# Altium project MB1248.PrjPCB (part 3 of 3)

## Sheet LCD&Camera Connectors.SchDoc: LCD & Camera connectors
size A4; Project: STM32H7-DK; Date: Not used; ApprovedBy: Not used; CheckedBy: Not used; Author: Not used; CompanyName: STMicroelectronics; DrawnBy: Not used; Engineer: Not used; Organization: Not used; Address1: Not used; Address2: Not used; Address3: Not used; Address4: Not used; DocumentNumber: Not used; Revision: Not used; SheetNumber: 7; SheetTotal: 16; CurrentTime: Not used; CurrentDate: Not used; Time: Not used; DocumentFullPathAndName: Not used; DocumentName: Not used; ModifiedDate: Not used; ImagePath: Not used; ProjectName: Not used; Application_BuildNumber: Not used
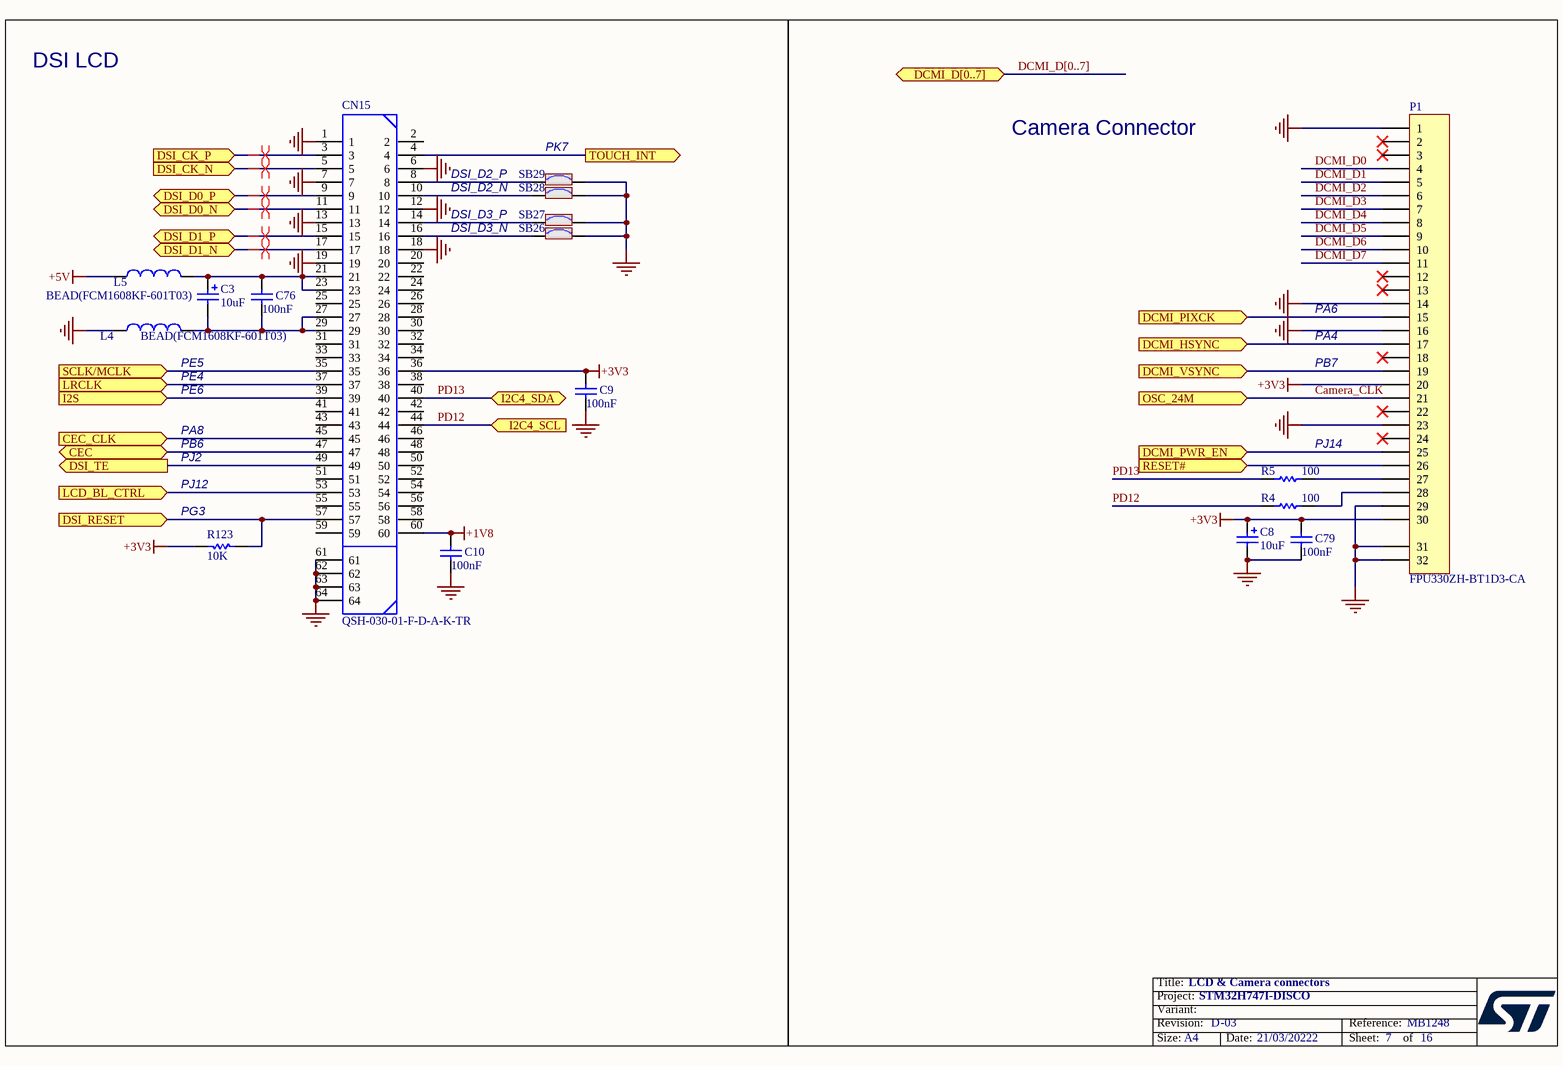
[diagram p11: LCD&Camera Connectors.SchDoc]

### Parts
C3  10uF  [TAN-A]
C8  10uF  [TAN-A]
C9  100nF  [0603C]
C10  100nF  [0603C]
C76  100nF  [0603C]
C79  100nF  [0603C]
CN15  QSH-030-01-F-D-A-K-TR  [QSH-030-01-F-D-A]
L4  BEAD(FCM1608KF-601T03)  [0603L]
L5  BEAD(FCM1608KF-601T03)  [0603L]
P1  FPU330ZH-BT1D3-CA  [FPU330ZH-BT1D3-CA]
R4  100  [0603R]
R5  100  [0603R]
R123  10K  [0603R]
SB26  Solder Bridge ON  [SB_0603]  (value not drawn)
SB27  Solder Bridge ON  [SB_0603]  (value not drawn)
SB28  Solder Bridge ON  [SB_0603]  (value not drawn)
SB29  Solder Bridge ON  [SB_0603]  (value not drawn)

### Ports
CEC (bidir), CEC_CLK (in), DCMI_D[0..7] (bidir), DCMI_HSYNC (in), DCMI_PIXCK (in), DCMI_PWR_EN (in), DCMI_VSYNC (in), DSI_CK_N (in), DSI_CK_P (in), DSI_D0_N (bidir), DSI_D0_P (bidir), DSI_D1_N (bidir), DSI_D1_P (bidir), DSI_RESET (in), DSI_TE (out), I2C4_SCL (in), I2C4_SDA (bidir), I2S (in), LCD_BL_CTRL (in), LRCLK (in), OSC_24M (in), RESET# (in), SCLK/MCLK (in), TOUCH_INT (out)

### Nets
+1V8: C10.1 CN15.60
+3V3: C8.1 C9.1 C79.2 CN15.36 P1.20 P1.30 R123.2
+5V: L5.1
GND: C8.2 C9.2 C10.2 C79.1 CN15.1 CN15.6 CN15.7 CN15.12 CN15.13 CN15.18 CN15.19 CN15.61 CN15.62 CN15.63 CN15.64 L4.1 P1.1 P1.14 P1.16 P1.23 P1.29 P1.31 P1.32 SB26.2 SB27.2 SB28.2 SB29.2
Camera_CLK: P1.21 ; port OSC_24M
DCMI_D0: P1.4
DCMI_D1: P1.5
DCMI_D2: P1.6
DCMI_D3: P1.7
DCMI_D4: P1.8
DCMI_D5: P1.9
DCMI_D6: P1.10
DCMI_D7: P1.11
PA4: P1.17 ; port DCMI_HSYNC
PA6: P1.15 ; port DCMI_PIXCK
PA8: CN15.45 ; port CEC_CLK
PB6: CN15.47 ; port CEC
PB7: P1.19 ; port DCMI_VSYNC
PD12: CN15.44 R4.1 ; port I2C4_SCL
PD13: CN15.40 R5.1 ; port I2C4_SDA
PG3: CN15.57 R123.1 ; port DSI_RESET
PJ2: CN15.49 ; port DSI_TE
PJ12: CN15.53 ; port LCD_BL_CTRL
PJ14: P1.25 ; port DCMI_PWR_EN
PK7: CN15.4 ; port TOUCH_INT
NetB1_2: P1.26 ; port RESET#
NetC3_1: C3.1 C76.1 CN15.21 CN15.23 L5.2
NetC3_2: C3.2 C76.2 CN15.27 CN15.29 L4.2
NetCN15_3: CN15.3 ; port DSI_CK_P
NetCN15_5: CN15.5 ; port DSI_CK_N
NetCN15_8: CN15.8 SB29.1
NetCN15_9: CN15.9 ; port DSI_D0_P
NetCN15_10: CN15.10 SB28.1
NetCN15_11: CN15.11 ; port DSI_D0_N
NetCN15_14: CN15.14 SB27.1
NetCN15_15: CN15.15 ; port DSI_D1_P
NetCN15_16: CN15.16 SB26.1
NetCN15_17: CN15.17 ; port DSI_D1_N
NetCN15_35: CN15.35 ; port SCLK/MCLK
NetCN15_37: CN15.37 ; port LRCLK
NetCN15_39: CN15.39 ; port I2S
NetP1_27: P1.27 R5.2
NetP1_28: P1.28 R4.2

Not connected (* = marked no-connect by the designer): CN15 2 20 22 24 25 26 28 30 31 32 33 34 38 41 42 43 46 48 50 51 52 54 55 56 58 59; P1 2* 3* 12* 13* 18* 22* 24*

### Buses and harness runs
bus DCMI_D[0..7] = port DCMI_D[0..7]

### Layout directives
differential pair: NetCN15_3, NetCN15_5, NetCN15_9, NetCN15_11, NetCN15_15, NetCN15_17

### Notes on the sheet
- DSI LCD
- DSI_D2_P
- DSI_D2_N
- PK7
- Camera Connector
- DSI_D3_P
- DSI_D3_N
- PA6
- PE6
- (near L4) PE5
- (near L4) PE4
- PA4
- PB7
- PJ2
- PB6
- PA8
- (near R5) PJ14
- PJ12
- (near R123) PG3
- Title:
- Project:
- Size:
- Revision:
- Variant:
- A4
- -
- Date:
- Reference:
- Sheet:
- of

### Library data of the parts
C3 C8 = Cap_10uF_POL_10%_TANA: Polarized Capacitor,10uF,10V,10%,typeA,VISHAY; Manuf_Part_1: 293D106X9010A2TE3; Revision: July-2002: Re-released for DXP Platform.; Value: 10uF; Manuf_1: VISHAY; Order: *; ECCN_US/EU: n/a
C9 C10 C76 = Cap: Capacitor; Value: 10nF; Published: 8-Jun-2000; Revision: July-2002: Re-released for DXP Platform.; Publisher: Altium Limited
C79 = Cap_100nF_X7R_10%_0402: Capacitor,100nF,16V,X7R,10%,0402,YAGEO; Revision: July-2002: Re-released for DXP Platform.; Value: 100nF; Manuf_1: YAGEO
CN15 = QSH-030-01-F-D-A: HIGH SPEED SOCKET STRIP, .5mm PITCH, 60 PINS; MANUFACTURER: SAMTEC; PCB DECAL: QSH-030-01-X-D-A; CREATED: 28 JAN 2014 - WENDY XIN
L4 L5 = Inductor: Value: 100uH; Published: 8-Jun-2000; Revision: July-2002: Re-released for DXP Platform.; Publisher: Altium Limited
P1 = FPU330ZH-BT1D3-CA: TOWNES -  Connector FFC/FPC ZIF 0.5mm 30 pins, Lower Contacts; Manuf_Part_2: TFP-A330ZH-BT1-ECX; Manuf_Part_1: FPU330ZH-BT1D3-CA; Order: *; Manuf_1: TOWNES; Distrib: Sub Co; ECCN_US/EU: n/a; Manuf_2: TOWNES
R4 R5 = Res_100_1%_0402: Resistor,100,0402,1%,YAGEO; Order: 9239111; Value: 100; Manuf_1: YAGEO; ECCN_US/EU: n/a; Distrib: FARNELL
R123 = Res1: Resistor; Value: 1K; Published: 8-Jun-2000; Revision: July-2002: Re-released for DXP Platform.; Publisher: Altium Limited
SB26-SB29 = SB_ON: Fitted: YES; Ordered by: Subcon; Revision: July-2002: Re-released for DXP Platform.; ECCN_US/EU: n/a

## Sheet DEBUG.SchDoc: TAG Connector
size A4; Project: STM32H7-DK; Date: Not used; ApprovedBy: Not used; CheckedBy: Not used; Author: Not used; CompanyName: STMicroelectronics; DrawnBy: Not used; Engineer: Not used; Organization: Not used; Address1: Not used; Address2: Not used; Address3: Not used; Address4: Not used; DocumentNumber: Not used; Revision: Not used; SheetNumber: 13; SheetTotal: 16; CurrentTime: Not used; CurrentDate: Not used; Time: Not used; DocumentFullPathAndName: Not used; DocumentName: Not used; ModifiedDate: Not used; ImagePath: Not used; ProjectName: Not used; Application_BuildNumber: Not used
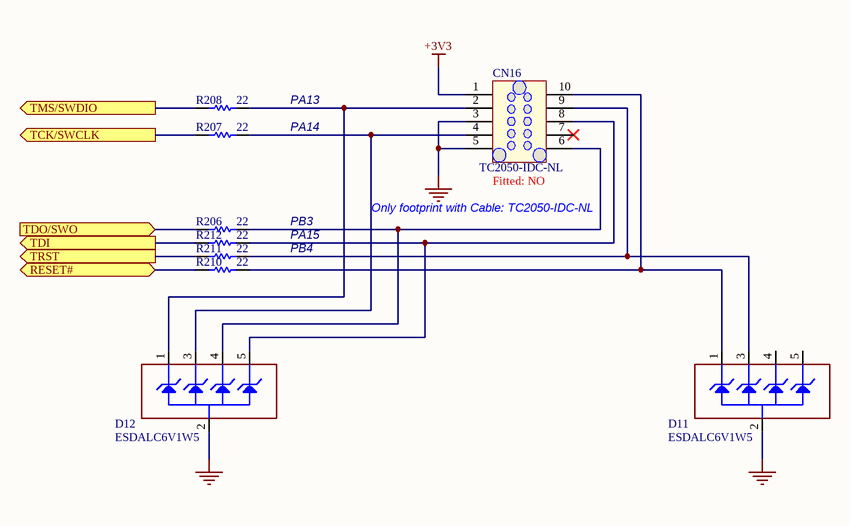
[diagram p12: DEBUG.SchDoc]

### Parts
CN16  TC2050-IDC-NL  Fitted: NO  [TC2050-IDC-NL]
D11  ESDALC6V1W5  [SC70-5]
D12  ESDALC6V1W5  [SC70-5]
R206  22  [0603R]
R207  22  [0603R]
R208  22  [0603R]
R210  22  [0603R]
R211  22  [0603R]
R212  22  [0603R]

### Ports
RESET# (bidir), TCK/SWCLK (out), TDI (out), TDO/SWO (in), TMS/SWDIO (out), TRST (out)

### Nets
+3V3: CN16.1
GND: CN16.3 CN16.5 D11.2(GND) D12.2(GND)
PA13: R208.2 ; port TMS/SWDIO
PA14: R207.2 ; port TCK/SWCLK
PA15: R212.2 ; port TDI
PB3: R206.2 ; port TDO/SWO
PB4: R211.2 ; port TRST
NetB1_2: R210.2 ; port RESET#
NetCN16_2: CN16.2 D12.1(IO1) R208.1
NetCN16_4: CN16.4 D12.3(IO2) R207.1
NetCN16_6: CN16.6 D12.4(IO3) R206.1
NetCN16_8: CN16.8 D12.5(IO4) R212.1
NetCN16_9: CN16.9 D11.3(IO2) R211.1
NetCN16_10: CN16.10 D11.1(IO1) R210.1

Not connected (* = marked no-connect by the designer): CN16 7*; D11 4(IO3) 5(IO4)

### Notes on the sheet
- PA13
- PA14
- PB3
- Only footprint with Cable: TC2050-IDC-NL
- PA15
- PB4
- Title:
- Project:
- Size:
- Revision:
- Variant:
- A4
- -
- Date:
- Reference:
- Sheet:
- of

### Library data of the parts
CN16 = Tag-10-C: Tag_Connector Header, 10-Pin, Dual row No legs; Manuf_Part_1: TC2050-IDC-NL-FP; Ordered_By: Subcon; Distrib: *; ECCN_US/EU: n/a; Manuf_1: Tag_connect; Order_code: *; Value: TC2050-IDC-NL; Ordered by: Subcon
D11 D12 = ESDALC6V1W5: Dual Transil array for ESD protection; Manuf_1: STM; Ref St: 9179034; Fitted: YES; ECCN_US/EU: EAR99/NEC; Manuf_Part_1: ESDALC6V1W5; Distrib: ST; Order: ESDALC6V1W5; Ordered by: STM
R206-R208 R210-R212 = Res1: Resistor; Value: 1K; Published: 8-Jun-2000; Revision: July-2002: Re-released for DXP Platform.; Publisher: Altium Limited

## Sheet STLink_V3E_Module.SchDoc: STLINK V3E Module
size A4; Project: STM32H7-DK; Date: Not used; ApprovedBy: Not used; CheckedBy: Not used; Author: Not used; CompanyName: STMicroelectronics; DrawnBy: Not used; Engineer: Not used; Organization: Not used; Address1: Not used; Address2: Not used; Address3: Not used; Address4: Not used; DocumentNumber: Not used; Revision: Not used; SheetNumber: 12; SheetTotal: 16; CurrentTime: Not used; CurrentDate: Not used; Time: Not used; DocumentFullPathAndName: Not used; DocumentName: Not used; ModifiedDate: Not used; ImagePath: Not used; ProjectName: Not used; Application_BuildNumber: Not used
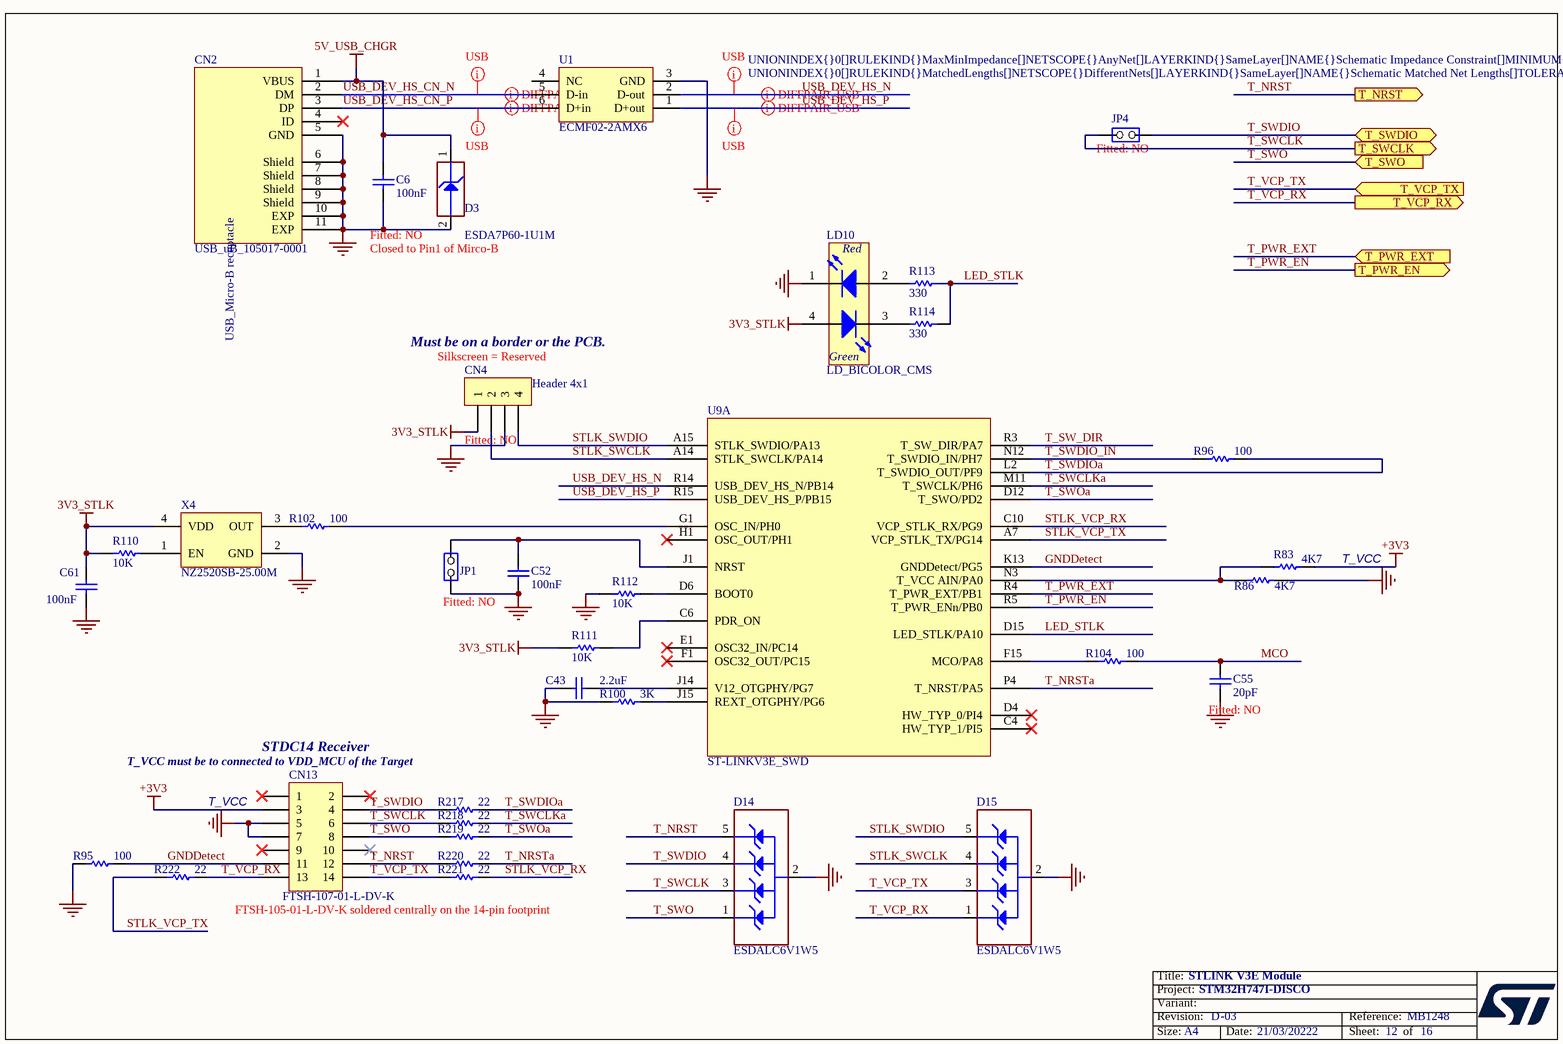
[diagram p13: STLink_V3E_Module.SchDoc]

### Parts
C6  value 100nF  Fitted: NO  [0402C]  (hidden comment: [N/A])
C43  2.2uF  [0603C]
C52  100nF  [0402C]
C55  value 20pF  Fitted: NO  [0402C]  (hidden comment: [N/A])
C61  100nF  [0402C]
CN2  value USB_uB_105017-0001  [MICRO_USB_B_105017]  (hidden comment: USB_uB_105017.0001)
CN4  Fitted: NO  [HDR_1X4_2R54]  (hidden comment: Header 4x1)
CN13  FTSH-107-01-L-DV-K  [FTSH-107-01-L-DV_B]
D3  ESDA7P60-1U1M  [DO_2SM_1R6X1_21]
D14  ESDALC6V1W5  [SC70-5]
D15  ESDALC6V1W5  [SC70-5]
JP1  Fitted: NO  [SIP2]  (hidden comment: Jumper Header 2x1)
JP4  Fitted: NO  [SIP2]  (hidden comment: Jumper Header 2x1)
LD10  LD_BICOLOR_CMS  [LED2_3528]
R83  4K7  [0402R]
R86  4K7  [0402R]
R95  100  [0402R]
R96  100  [0402R]
R100  3K  [0402R]
R102  100  [0402R]
R104  100  [0402R]
R110  10K  [0402R]
R111  10K  [0402R]
R112  10K  [0402R]
R113  330  [0603R]
R114  330  [0603R]
R217  22  [0603R]
R218  22  [0603R]
R219  22  [0603R]
R220  22  [0603R]
R221  22  [0603R]
R222  22  [0603R]
U1  ECMF02-2AMX6  [DFN6_0R5_1R7X1R5]
U9  ST-LINKV3E_SWD  [BGA176_0R65_10x10]  (part A of 2)
X4  NZ2520SB-25.00M  [OSC_4SM_2R5X2]

### Ports
T_NRST (out), T_PWR_EN (out), T_PWR_EXT (in), T_SWCLK (out), T_SWDIO (bidir), T_SWO (in), T_VCP_RX (out), T_VCP_TX (in)

### Nets
3V3_STLK: C61.2 CN4.1 LD10.4(YellowGreen_anode) R110.1 R111.1 X4.4(VDD)
5V_USB_CHGR: C6.2 CN2.1(VBUS) D3.1(IO1)
+3V3: CN13.3 R83.2
GND: C6.1 C43.1 C52.1 C55.1 C61.1 CN2.5(GND) CN2.6(Shield) CN2.7(Shield) CN2.8(Shield) CN2.9(Shield) CN2.10(EXP) CN2.11(EXP) CN4.3 CN13.5 CN13.7 D3.2(GND) D14.2(GND) D15.2(GND) JP1.1(COMMON) LD10.1(RED_cathode) R86.2 R95.1 R100.1 R112.1 U1.3(GND) X4.2(GND)
GNDDetect: CN13.11 R95.2 U9.K13(GNDDetect/PG5)
LED_STLK: R113.2 R114.2 U9.D15(LED_STLK/PA10)
MCO: C55.2 R104.2
STLK_SWCLK: CN4.2 D15.4(IO3) U9.A14(STLK_SWCLK/PA14)
STLK_SWDIO: CN4.4 D15.5(IO4) U9.A15(STLK_SWDIO/PA13)
STLK_VCP_RX: R221.1 U9.C10(VCP_STLK_RX/PG9)
STLK_VCP_TX: R222.2 U9.A7(VCP_STLK_TX/PG14)
T_NRST: CN13.12 D14.5(IO4) R220.2 ; port T_NRST
T_NRSTa: R220.1 U9.P4(T_NRST/PA5)
T_PWR_EN: U9.R5(T_PWR_ENn/PB0) ; port T_PWR_EN
T_PWR_EXT: U9.R4(T_PWR_EXT/PB1) ; port T_PWR_EXT
T_SW_DIR: U9.R3(T_SW_DIR/PA7)
T_SWCLK: CN13.6 D14.3(IO2) JP4.1(COMMON) R218.2 ; port T_SWCLK
T_SWCLKa: R218.1 U9.M11(T_SWCLK/PH6)
T_SWDIO: CN13.4 D14.4(IO3) JP4.2(NO) R217.2 ; port T_SWDIO
T_SWDIO_IN: R96.1 U9.N12(T_SWDIO_IN/PH7)
T_SWDIOa: R96.2 R217.1 U9.L2(T_SWDIO_OUT/PF9)
T_SWO: CN13.8 D14.1(IO1) R219.2 ; port T_SWO
T_SWOa: R219.1 U9.D12(T_SWO/PD2)
T_VCP_RX: CN13.13 D15.1(IO1) R222.1 ; port T_VCP_RX
T_VCP_TX: CN13.14 D15.3(IO2) R221.2 ; port T_VCP_TX
USB_DEV_HS_CN_N: CN2.2(DM) U1.5(D-in)
USB_DEV_HS_CN_P: CN2.3(DP) U1.6(D+in)
USB_DEV_HS_N: U1.2(D-out) U9.R14(USB_DEV_HS_N/PB14)
USB_DEV_HS_P: U1.1(D+out) U9.R15(USB_DEV_HS_P/PB15)
NetC43_2: C43.2 U9.J14(V12_OTGPHY/PG7)
NetC52_2: C52.2 JP1.2(NO) U9.J1(NRST)
NetLD10_2: LD10.2(Red_anode) R113.1
NetLD10_3: LD10.3(YellowGreen_cathode) R114.1
NetR83_1: R83.1 R86.1 U9.N3(T_VCC_AIN/PA0)
NetR100_2: R100.2 U9.J15(REXT_OTGPHY/PG6)
NetR102_1: R102.1 X4.3(OUT)
NetR102_2: R102.2 U9.G1(OSC_IN/PH0)
NetR104_1: R104.1 U9.F15(MCO/PA8)
NetR110_2: R110.2 X4.1(EN)
NetR111_2: R111.2 U9.C6(PDR_ON)
NetR112_2: R112.2 U9.D6(BOOT0)

Not connected (* = marked no-connect by the designer): CN2 4(ID)*; CN13 1* 2* 9* 10*; U1 4(NC); U9 C4(HW_TYP_1/PI5)* D4(HW_TYP_0/PI4)* E1(OSC32_IN/PC14)* F1(OSC32_OUT/PC15)* H1(OSC_OUT/PH1)*

### Layout directives
differential pair; rule Impedance Constraint [Min = 85.00    Max = 95.00    ]: USB_DEV_HS_CN_N, USB_DEV_HS_CN_P, USB_DEV_HS_N, USB_DEV_HS_P
rule Undefined; rule Matched Net Lengths [Tolerance = 0.2mm]; rule Impedance Constraint [Min = 85.00    Max = 95.00    ]: USB_DEV_HS_CN_N, USB_DEV_HS_CN_P, USB_DEV_HS_N, USB_DEV_HS_P

### Notes on the sheet
- (near D3) Closed to Pin1 of Mirco-B
- Must be on a border or the PCB.
- (near CN4) Silkscreen = Reserved
- (near R83) T_VCC
- T_VCC must be to connected to VDD_MCU of the Target
- (near CN13) STDC14 Receiver
- T_VCC
- FTSH-105-01-L-DV-K soldered centrally on the 14-pin footprint
- Title:
- Project:
- Size:
- Revision:
- Variant:
- A4
- -
- Date:
- Reference:
- Sheet:
- of
- (in symbol MCD-00028) USB_Micro-B receptacle
- (in symbol MCD-00051) Red; Green

### Library data of the parts
C6 C55 = MCD-00016: Capacitor,20pF,50V,NPO,5%,0402; Manufacturer_Part_Number: CC0402JRNPO9BN200; Manufacturer: YAGEO; Provided_By: Subcon; Initial_Board_Reference: mb1274; Internal_Part_Number: MCD-00016; Status: Released; Package: 0402; ComponentLink1Description: Yageo_Capacitor_NP0_16V-to-50V.pdf; ECCN_US: n/a; ECCN_EU: n/a; Part_Type: Capacitor
C43 = MCD-00012: Capacitor,2.2uF,10V, X5R,10%,0603; Manufacturer_Part_Number: CC0603KRX5R6BB225; Manufacturer: YAGEO; Alternate_Manufacturer_Part_Number: C0603C225K8PACTU; Alternate_Manufacturer: KEMET; Provided_By: Subcon; Initial_Board_Reference: mb1274; Internal_Part_Number: MCD-00012; Value: 2.2uF; Status: Released; Package: 0603; ComponentLink1Description: Yageo_Capacitor_X5R-series.pdf; ECCN_US: n/a; ECCN_EU: n/a; Part_Type: Capacitor
C52 C61 = MCD-00102: Capacitor,100nF,16V,X7R,10%,0402; Manufacturer_Part_Number: CC0402KRX7R7BB104; Manufacturer: YAGEO; Provided_By: Subcon; Initial_Board_Reference: mb1262; Internal_Part_Number: MCD-00102; Value: 100nF; Status: Released; Package: 0402; ComponentLink1Description: Capacitor_X7R_100pF_to_22uF.pdf; ECCN_US: n/a; ECCN_EU: n/a; Part_Type: Capacitor
CN2 = MCD-00028: USB-MICRO-B, 0.65mm, RA, SMT, Bottom Mount,; Manufacturer_Part_Number: 1050170001; Manufacturer: MOLEX; Part_Type: Connector; Provided_By: Subcon; Initial_Board_Reference: mb1274; Internal_Part_Number: MCD-00028; Status: Released; ComponentLink1Description: Molex_Connector-USB-uB_1050170001.pdf; ECCN_US: n/a; ECCN_EU: n/a
CN4 = MCD-00029: Header, 4x1, 2,54mm, VR, TH, Height 5.84mm/2.54mm; Manufacturer_Part_Number: TSW-104-07-x-S; Manufacturer: SAMTEC; Part_Type: Connector; Provided_By: Subcon; Initial_Board_Reference: mb1274; Internal_Part_Number: MCD-00029; Value: Header 4x1; Status: Released; ComponentLink1Description: Samtec_Connector_TSW-HTSW-series.pdf; ECCN_US: n/a; ECCN_EU: n/a
CN13 = MCD-00592: Header 7x2, 1.27mm, Dual row, Straight; Manufacturer_Part_Number: FTSH-107-01-L-DV-009-ES-A; Manufacturer: SAMTEC; Part_Type: Connector; Provided_By: Subcon; Initial_Board_Reference: mb1331; Internal_Part_Number: MCD-00592; Value: FTSH-107-01-L-DV-K; Status: Symbol available; ComponentLink1Description: Samtec_ftsh_smt.pdf; ComponentLink1URL: http://tunmcdsvn.tun.st.com/Component_Datasheet_Library/Trunk/Connectors/Samtec_ftsh_smt.pdf
D3 = ESDALC6V1-1U2: Dual Transil array for ESD protection; Manuf_1: STM; Ref St: .; ECCN_US/EU: EAR99/NEC; Fitted: NO; Provided: ST; Manuf_Part_1: ESDA7P60-1U1M; Distrib: ST; Ordered by: STM; Order: ESDA7P60-1U1M
D14 D15 = ESDALC6V1W5: as D11 on sheet DEBUG; Manuf_Part_1: ESDALC6V1W5; Distrib: ST; Order: ESDALC6V1W5; Ordered by: STM
JP1 JP4 = MCD-00045: Header, 2x1, 2,54mm, VR, TH, Height 5.84mm/2.54mm; Manufacturer_Part_Number: TSW-102-07-x-S; Manufacturer: SAMTEC; Part_Type: Connector; Value: Jumper_Header_2x1; Provided_By: Subcon; Initial_Board_Reference: mb1274; Internal_Part_Number: MCD-00045; Status: Released; ComponentLink1Description: Samtec_Connector_TSW-HTSW-series.pdf; ECCN_US: n/a; ECCN_EU: n/a
LD10 = MCD-00051: LED Bicolor; Part_Type: Display; Manufacturer_Part_Number: HSMF-A201-A00J1; Manufacturer: AVAGO TECHNOLOGIES; Alternate_Manufacturer_Part_Number: LE-RGW35280; Alternate_Manufacturer: EVERLUCK; ECCN_US: EAR99; ECCN_EU: NEC; Provided_By: Subcon; Initial_Board_Reference: mb1274; Internal_Part_Number: MCD-00051; Value: LD_BICOLOR_CMS; Status: Released; ComponentLink1Description: Avago_LED-SMC_HSMx-A2xx-02Feb2012.pdf
R83 R86 = MCD-00065: Resistor,4K7,0402,1%,1/16W; Manufacturer_Part_Number: RC0402FR-074K7L; Manufacturer: YAGEO; Alternate_Manufacturer_Part_Number: RT0402FRE074K7L; Provided_By: Subcon; Initial_Board_Reference: mb1274; Internal_Part_Number: MCD-00065; Value: 4K7; Status: Released; ComponentLink1Description: Yageo_Resistor_RC0402-series.pdf; ECCN_US: n/a; ECCN_EU: n/a; Alternate_Manufacturer: YAGEO; Part_Type: Resistor
R95 R96 R102 R104 = MCD-00119: Resistor,100R,0402,1%,1/16W; Manufacturer_Part_Number: RC0402FR-07100RL; Manufacturer: YAGEO; Provided_By: Subcon; Initial_Board_Reference: mb1262; Internal_Part_Number: MCD-00119; Value: 100; Status: Released; Part_Type: Resistor; ComponentLink1Description: Yageo_Resistor_RC0402-series.pdf; ECCN_US: n/a; ECCN_EU: n/a
R100 = MCD-00185: Resistor,3K,0402,1%,1/16W; Manufacturer_Part_Number: RC0402FR-073KL; Manufacturer: YAGEO; Provided_By: Subcon; Internal_Part_Number: MCD-00185; Value: 3K; Status: Released; ComponentLink1Description: Yageo_Resistor_RC0402-series.pdf; ECCN_US: n/a; ECCN_EU: n/a; Part_Type: Resistor
R110-R112 = MCD-00053: Resistor,10K,0402,1%,1/16W; Manufacturer_Part_Number: RC0402FR-0710KL; Manufacturer: YAGEO; Provided_By: subcon; Initial_Board_Reference: mb1274; Internal_Part_Number: MCD-00053; Value: 10K; Status: Released; ComponentLink1Description: Yageo_Resistor_RC0402-series.pdf; ECCN_US: n/a; ECCN_EU: n/a; Part_Type: Resistor
R113 R114 = MCD-00197: Resistor,330R,0603,1%,1/10W; Manufacturer_Part_Number: RC0603FR-07330RL; Manufacturer: YAGEO; Provided_By: Subcon; Internal_Part_Number: MCD-00197; Value: 330; Status: Released; ComponentLink1Description: Yageo_Resistor_RC0603-series.pdf; ECCN_US: n/a; ECCN_EU: n/a; Part_Type: Resistor
R217-R222 = Res1: Resistor; Value: 1K; Published: 8-Jun-2000; Revision: July-2002: Re-released for DXP Platform.; Publisher: Altium Limited
U1 = ECMF02-2AMX6: Common mode filter with ESD protection for USB 2.0 interface; Manuf_1: STM; ECCN_US/EU: EAR99/NEC; Fitted: YES; Manuf_Part_1: ECMF02-2AMX6; Ordered by: STM; Value: ECMF02-2AMX6
U9 = ST-LINKV3E_SWD: STM32F723IEK  (STM32F7 LittleBirdie) BGA176; Internal_Part_Number: MCD-00596; Manuf_Part_1: STM32F723IEK6; Manuf_1: STM; Initial_Board_Reference: mb1331; Fitted: YES; ECCN_US/EU: 3A991A2/NEC; Value: ST-LINKV3E_SWD; ComponentLink1Description: BGA176+25L_10x10x0.6_pitch0.65.pdf; ComponentLink1URL: http://tunmcdsvn.tun.st.com/Component_Datasheet_Library/Trunk/IC/BGA176+25L_10x10x0.6_pitch0.65.pdf; Ordered by: STM
X4 = OSC_25M_NZ2520SB: Oscillator 25.00Mhz, -+50PPM, 3.3V, Temp -55 to +125癈; Manuf_Part_1: NZ2520SB 25MHz END4869B; Manuf_1: NDK; Manuf_Part_2: KC2520B25.0000C10E00; Manuf_2: AVX Corp/Kyocera Corp; Ordered by: STM; ECCN_US/EU: EAR99/NEC; Ref St: 9157031; Fitted: YES

## Sheet STLink_V3E_PWR.SchDoc: STLINK V3E PWR
size A4; Project: STM32H7-DK; Date: Not used; ApprovedBy: Not used; CheckedBy: Not used; Author: Not used; CompanyName: STMicroelectronics; DrawnBy: Not used; Engineer: Not used; Organization: Not used; Address1: Not used; Address2: Not used; Address3: Not used; Address4: Not used; DocumentNumber: Not used; Revision: Not used; SheetNumber: 16; SheetTotal: 16; CurrentTime: Not used; CurrentDate: Not used; Time: Not used; DocumentFullPathAndName: Not used; DocumentName: Not used; ModifiedDate: Not used; ImagePath: Not used; ProjectName: Not used; Application_BuildNumber: Not used
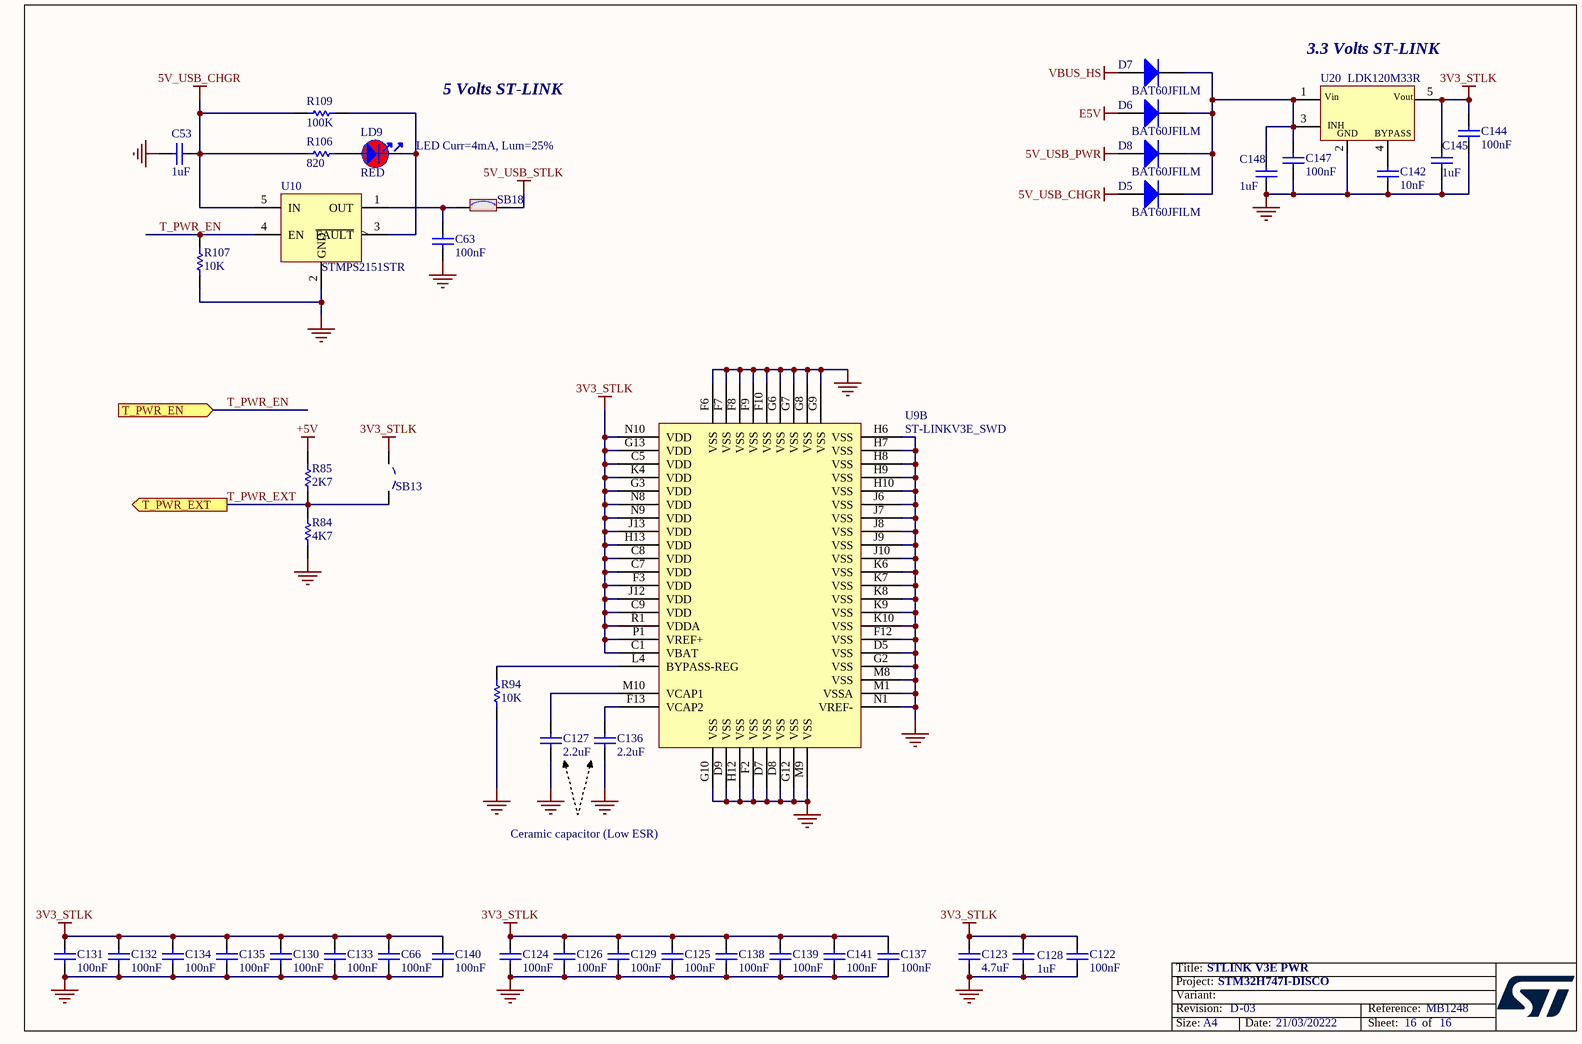
[diagram p14: STLink_V3E_PWR.SchDoc]

### Parts
C53  1uF  [0603C]
C63  100nF  [0603C]
C66  100nF  [0402C]
C122  100nF  [0603C]
C123  4.7uF  [0603C]
C124  100nF  [0402C]
C125  100nF  [0402C]
C126  100nF  [0402C]
C127  2.2uF  [1206C]
C128  1uF  [0603C]
C129  100nF  [0402C]
C130  100nF  [0402C]
C131  100nF  [0402C]
C132  100nF  [0402C]
C133  100nF  [0402C]
C134  100nF  [0402C]
C135  100nF  [0402C]
C136  2.2uF  [1206C]
C137  100nF  [0402C]
C138  100nF  [0402C]
C139  100nF  [0402C]
C140  100nF  [0402C]
C141  100nF  [0402C]
C142  10nF  [0603C]
C144  100nF  [0603C]
C145  1uF  [0603C]
C147  100nF  [0603C]
C148  1uF  [0603C]
D5  BAT60JFILM  [SOD-323]
D6  BAT60JFILM  [SOD-323]
D7  BAT60JFILM  [SOD-323]
D8  BAT60JFILM  [SOD-323]
LD9  value RED  [0603D]  (hidden comment: LED_red)
R84  4K7  [0402R]
R85  2K7  [0402R]
R94  10K  [0402R]
R106  820  [0603R]
R107  10K  [0603R]
R109  100K  [0402R]
SB13  Solder Bridge OFF  [SB_0603]  (value not drawn)
SB18  Solder Bridge ON  [SB_0603]  (value not drawn)
U9  ST-LINKV3E_SWD  [BGA176_0R65_10x10]  (part B of 2)
U10  STMPS2151STR  [SOT23-5]
U20  LDK120M33R  [SOT23-5]

### Ports
T_PWR_EN (in), T_PWR_EXT (out)

### Nets
3V3_STLK: C66.2 C122.2 C123.2 C124.2 C125.2 C126.2 C128.2 C129.2 C130.2 C131.2 C132.2 C133.2 C134.2 C135.2 C137.2 C138.2 C139.2 C140.2 C141.2 C144.2 C145.2 SB13.1 U9.C1(VBAT) U9.C5(VDD) U9.C7(VDD) U9.C8(VDD) U9.C9(VDD) U9.F3(VDD) U9.G3(VDD) U9.G13(VDD) U9.H13(VDD) U9.J12(VDD) U9.J13(VDD) U9.K4(VDD) U9.N8(VDD) U9.N9(VDD) U9.N10(VDD) U9.P1(VREF+) U9.R1(VDDA) U20.5(Vout)
5V_USB_CHGR: C53.1 D5.1(A) R106.1 R109.2 U10.5(IN)
5V_USB_PWR: D8.1(A)
5V_USB_STLK: SB18.2
+5V: R85.2
E5V: D6.1(A)
GND: C53.2 C63.1 C66.1 C122.1 C123.1 C124.1 C125.1 C126.1 C127.1 C128.1 C129.1 C130.1 C131.1 C132.1 C133.1 C134.1 C135.1 C136.1 C137.1 C138.1 C139.1 C140.1 C141.1 C142.1 C144.1 C145.1 C147.1 C148.2 R84.1 R94.1 R107.1 U9.D5(VSS) U9.D7(VSS) U9.D8(VSS) U9.D9(VSS) U9.F2(VSS) U9.F6(VSS) U9.F7(VSS) U9.F8(VSS) U9.F9(VSS) U9.F10(VSS) U9.F12(VSS) U9.G2(VSS) U9.G6(VSS) U9.G7(VSS) U9.G8(VSS) U9.G9(VSS) U9.G10(VSS) U9.G12(VSS) U9.H6(VSS) U9.H7(VSS) U9.H8(VSS) U9.H9(VSS) U9.H10(VSS) U9.H12(VSS) U9.J6(VSS) U9.J7(VSS) U9.J8(VSS) U9.J9(VSS) U9.J10(VSS) U9.K6(VSS) U9.K7(VSS) U9.K8(VSS) U9.K9(VSS) U9.K10(VSS) U9.M1(VSSA) U9.M8(VSS) U9.M9(VSS) U9.N1(VREF-) U10.2(GND) U20.2(GND)
VBUS_HS: D7.1(A)
T_PWR_EN: R107.2 U10.4(EN) ; port T_PWR_EN
T_PWR_EXT: R84.2 R85.1 SB13.2 ; port T_PWR_EXT
NetC63_2: C63.2 SB18.1 U10.1(OUT)
NetC127_2: C127.2 U9.M10(VCAP1)
NetC136_2: C136.2 U9.F13(VCAP2)
NetC142_2: C142.2 U20.4(BYPASS)
NetC147_2: C147.2 C148.1 D5.2(K) D6.2(K) D7.2(K) D8.2(K) U20.1(Vin) U20.3(CE)
NetLD9_1: LD9.1 R106.2
NetLD9_2: LD9.2 R109.1 U10.3(~{FAULT})
NetR94_2: R94.2 U9.L4(BYPASS-REG)

### Notes on the sheet
- 5 Volts ST-LINK
- (near U20) 3.3 Volts ST-LINK
- (near LD9) LED Curr=4mA, Lum=25%
- Ceramic capacitor (Low ESR)
- Title:
- Project:
- Size:
- Revision:
- Variant:
- A4
- -
- Date:
- Reference:
- Sheet:
- of
- (in symbol MCD-00086) INH

### Library data of the parts
C53 C128 C145 = MCD-00010: Capacitor,1uF,16V,X5R,10%,0603; Manufacturer_Part_Number: CC0603KRX5R7BB105; Manufacturer: YAGEO; Provided_By: Subcon; Initial_Board_Reference: mb1274; Internal_Part_Number: MCD-00010; Value: 1uF; Status: Released; Package: 0603; ComponentLink1Description: Yageo_Capacitor_X5R-series.pdf; ECCN_US: n/a; ECCN_EU: n/a; Part_Type: Capacitor
C63 = MCD-00006: Capacitor, MLCC, 100nF, 16V, X7R, 10%, 0402, T=0.5mm; Manufacturer_Part_Number: CC0402KRX7R7BB104; Manufacturer: YAGEO; Provided_By: Subcon; Initial_Board_Reference: MB1274; Internal_Part_Number: MCD-00006; Value: 100nF; Status: Released; Package: C0402; ComponentLink1Description: Yageo_Capacitor_X7R-series.pdf; ECCN_US: n/a; ECCN_EU: n/a; Part_Type: Capacitor; ComponentLink1URL: http://tunmcdsvn.tun.st.com/Component_Datasheet_Library/Trunk/Capacitors/Yageo_Multilayer_Capacitor_X7R_series_100pF_to_22uF
C66 C124-C126 C129-C135 C137-C141 = MCD-00102: Capacitor,100nF,16V,X7R,10%,0402; Manufacturer_Part_Number: CC0402KRX7R7BB104; Manufacturer: YAGEO; Provided_By: Subcon; Initial_Board_Reference: mb1262; Internal_Part_Number: MCD-00102; Value: 100nF; Status: Released; Package: 0402; ComponentLink1Description: Capacitor_X7R_100pF_to_22uF.pdf; ECCN_US: n/a; ECCN_EU: n/a; Part_Type: Capacitor
C122 C144 C147 = MCD-00211: Capacitor,100nF,16V,X7R,10%,0603; Manufacturer_Part_Number: CC0603KRX7R7BB104; Manufacturer: YAGEO; Provided_By: Subcon; Initial_Board_Reference: mb1319; Internal_Part_Number: MCD-00211; Value: 100nF; Status: Released; Package: 0603; ComponentLink1Description: Yageo_Capacitor_X7R-series.pdf; ECCN_US: n/a; ECCN_EU: n/a; Part_Type: Capacitor
C123 = MCD-00009: Capacitor,4.7uF,16V, X5R,10%,0603; Manufacturer_Part_Number: CC0603KRX5R7BB475; Manufacturer: YAGEO; Provided_By: subcon; Initial_Board_Reference: mb1274; Internal_Part_Number: MCD-00009; Value: 4.7uF; Status: Released; Part_Type: Capacitor; Package: 0603; ComponentLink1Description: Yageo_Capacitor_X5R-series.pdf; ECCN_US: n/a; ECCN_EU: n/a
C127 C136 = MCD-00008: Capacitor,2.2uF,16V, X7R,10%,1206; Manufacturer_Part_Number: CC1206KKX7R7BB225; Manufacturer: YAGEO; Alternate_Manufacturer_Part_Number: C1206C225K4RAC; Alternate_Manufacturer: KEMET; Provided_By: Subcon; Initial_Board_Reference: mb1274; Internal_Part_Number: MCD-00008; Value: 2.2uF; Status: Released; Package: 1206; ComponentLink1Description: Yageo_Capacitor_X7R-series.pdf; ECCN_US: n/a; ECCN_EU: n/a; Part_Type: Capacitor
C142 = MCD-00017: Capacitor,10nF,50V,X7R,10%,0603; Manufacturer_Part_Number: CC0603KRX7R9BB103; Manufacturer: YAGEO; Provided_By: Subcon; Initial_Board_Reference: mb1274; Internal_Part_Number: MCD-00017; Value: 10nF; Status: Released; Package: 0603; ComponentLink1Description: Yageo_Capacitor_X7R-series.pdf; ECCN_US: n/a; ECCN_EU: n/a; Part_Type: Capacitor
C148 = MCD-00238: Capacitor,1uF,6V3,X5R,10%,0603; Manufacturer_Part_Number: CC0603KRX5R5BB105; Manufacturer: YAGEO; Provided_By: Subcon; Initial_Board_Reference: mb1319; Internal_Part_Number: MCD-00238; Value: 1uF; Status: Released; Part_Type: Capacitor; Package: 0603; ComponentLink1Description: Yageo_Capacitor_X5R-series.pdf; ECCN_US: n/a; ECCN_EU: n/a
D5-D8 = MCD-00034: Manuf_1: STM; ECCN_US/EU: EAR99/NEC; Fitted: YES; Initial_Board_Reference: mb1274; Internal_Part_Number: MCD-00034; Value: BAT60JFILM; Status: Released; Manuf_Part_1: BAT60JFILM; ComponentLink1Description: STM_Diode_BAT60JFILM-SOD323.pdf; Ordered by: STM
LD9 = MCD-00587: LED Red, 0603 SMD, 2V Forward Voltage; Part_Type: Display; Manufacturer_Part_Number: VLMS1300-GS08; Manufacturer: VISHAY; Alternate_Manufacturer_Part_Number: LS Q976-NR-1; Alternate_Manufacturer: OSRAM OPTO SEMICONDUCTORS; Provided_By: Subcon; Initial_Board_Reference: MB1331; Internal_Part_Number: MCD-00587; Status: Footprint available; ComponentLink1Description: VISHAY_LED_RED_VLMS1300-GS08.pdf; ComponentLink1URL: http://tunmcdsvn.tun.st.com/Component_Datasheet_Library/Trunk/display/VISHAY_LED_RED_VLMS1300-GS08; Order_Code_Digikey: VLMS1300-GS08CT-ND; Order_Code_Farnell: 2078728; Package: LED 0603; ECCN_US: n/a; ECCN_EU: n/a
R84 = MCD-00065: Resistor,4K7,0402,1%,1/16W; Manufacturer_Part_Number: RC0402FR-074K7L; Manufacturer: YAGEO; Alternate_Manufacturer_Part_Number: RT0402FRE074K7L; Provided_By: Subcon; Initial_Board_Reference: mb1274; Internal_Part_Number: MCD-00065; Value: 4K7; Status: Released; ComponentLink1Description: Yageo_Resistor_RC0402-series.pdf; ECCN_US: n/a; ECCN_EU: n/a; Alternate_Manufacturer: YAGEO; Part_Type: Resistor
R85 = MCD-00055: Resistor,2K7,0402,1%,1/16W; Manufacturer_Part_Number: RC0402FR-072K7L; Manufacturer: YAGEO; Provided_By: Subcon; Initial_Board_Reference: mb1274; Internal_Part_Number: MCD-00055; Value: 2K7; Status: Released; ComponentLink1Description: Yageo_Resistor_RC0402-series.pdf; ECCN_US: n/a; ECCN_EU: n/a; Part_Type: Resistor
R94 = MCD-00053: Resistor,10K,0402,1%,1/16W; Manufacturer_Part_Number: RC0402FR-0710KL; Manufacturer: YAGEO; Provided_By: subcon; Initial_Board_Reference: mb1274; Internal_Part_Number: MCD-00053; Value: 10K; Status: Released; ComponentLink1Description: Yageo_Resistor_RC0402-series.pdf; ECCN_US: n/a; ECCN_EU: n/a; Part_Type: Resistor
R106 = MCD-00527: Resistor,820R,0402,1%,1/16W; Manufacturer_Part_Number: RC0402FR-07820RL; Manufacturer: YAGEO; Provided_By: Subcon; Internal_Part_Number: MCD-00527; Value: 820; Status: Released; Part_Type: Resistor; Package: R0402; ComponentLink1Description: Yageo_Resistor_RC0402-series.pdf; ComponentLink1URL: http://tunmcdsvn.tun.st.com/Component_Datasheet_Library/Trunk/Resistors/Yageo_Resistor_RC0402-series; ECCN_US: n/a; ECCN_EU: n/a
R107 = MCD-00053: Resistor,10K,0402,1%,1/16W; Manufacturer_Part_Number: RC0402FR-0710KL; Manufacturer: YAGEO; Provided_By: subcon; Initial_Board_Reference: MB1274; Internal_Part_Number: MCD-00053; Value: 10K; Status: Released; ComponentLink1Description: Yageo_Resistor_RC0402-series.pdf; ECCN_US: n/a; ECCN_EU: n/a; Part_Type: Resistor; Package: R0402; ComponentLink1URL: http://tunmcdsvn.tun.st.com/Component_Datasheet_Library/Trunk/Resistors/Yageo_Resistor_RC0402-series
R109 = MCD-00059: Resistor,100K,0402,1%,1/16W; Manufacturer_Part_Number: RC0402FR-07100KL; Manufacturer: YAGEO; Alternate_Manufacturer_Part_Number: RT0402FRE07100KL; Provided_By: Subcon; Initial_Board_Reference: mb1274; Internal_Part_Number: MCD-00059; Value: 100K; Status: Released; ComponentLink1Description: Yageo_Resistor_RC0402-series.pdf; ECCN_US: n/a; ECCN_EU: n/a; Alternate_Manufacturer: YAGEO; Part_Type: Resistor
SB13 = SB_OFF: Fitted: NO; Ordered by: Subcon; Revision: July-2002: Re-released for DXP Platform.; ECCN_US/EU: n/a
SB18 = SB_ON: Fitted: YES; Ordered by: Subcon; Revision: July-2002: Re-released for DXP Platform.; ECCN_US/EU: n/a
U9 = ST-LINKV3E_SWD: STM32F723IEK  (STM32F7 LittleBirdie) BGA176; Internal_Part_Number: MCD-00596; Manuf_Part_1: STM32F723IEK6; Manuf_1: STM; Initial_Board_Reference: mb1331; Fitted: YES; ECCN_US/EU: 3A991A2/NEC; Value: ST-LINKV3E_SWD; ComponentLink1Description: BGA176+25L_10x10x0.6_pitch0.65.pdf; ComponentLink1URL: http://tunmcdsvn.tun.st.com/Component_Datasheet_Library/Trunk/IC/BGA176+25L_10x10x0.6_pitch0.65.pdf; Ordered by: STM
U10 = MCD-00159: 500mA, Enhanced single channel power switches with active high enable pin; Part_Type: IC; Manufacturer: STMICROELECTRONICS; ECCN_US: EAR99; ECCN_EU: NEC; Provided_By: Subcon; Initial_Board_Reference: MB1264; Internal_Part_Number: MCD-00159; Value: STMPS2151STR; Status: Footprint available; Manufacturer_Part_Number: STMPS2151STR; ComponentLink1Description: STM_PWR-Switch_STMPS2151STR.pdf; ComponentLink1URL: http://tunmcdsvn.tun.st.com/Component_Datasheet_Library/Trunk/IC/STM_PWR-Switch_STMPS2151STR
U20 = MCD-00086: Ultra low drop-low noise BiCMOS voltage, regulators low ESR capacitors compatible; Manuf_1: STM; ECCN_US/EU: EAR99/NEC; Fitted: YES; Initial_Board_Reference: mb1248; Internal_Part_Number: MCD-00086; Value: LDK120M33R; Status: Released; Manuf_Part_1: LDK120M33R; ComponentLink1Description: STM_LDO_LD3985.pdf; Ordered by: STM

## Sheet PMOD_STMod+ connector .SchDoc: PMOD STMod+ Connector
size A4; Project: STM32H7-DK; Date: Not used; ApprovedBy: Not used; CheckedBy: Not used; Author: Not used; CompanyName: STMicroelectronics; DrawnBy: Not used; Engineer: Not used; Organization: Not used; Address1: Not used; Address2: Not used; Address3: Not used; Address4: Not used; DocumentNumber: Not used; Revision: Not used; SheetNumber: 11; SheetTotal: 16; CurrentTime: Not used; CurrentDate: Not used; Time: Not used; DocumentFullPathAndName: Not used; DocumentName: Not used; ModifiedDate: Not used; ImagePath: Not used; ProjectName: Not used; Application_BuildNumber: Not used
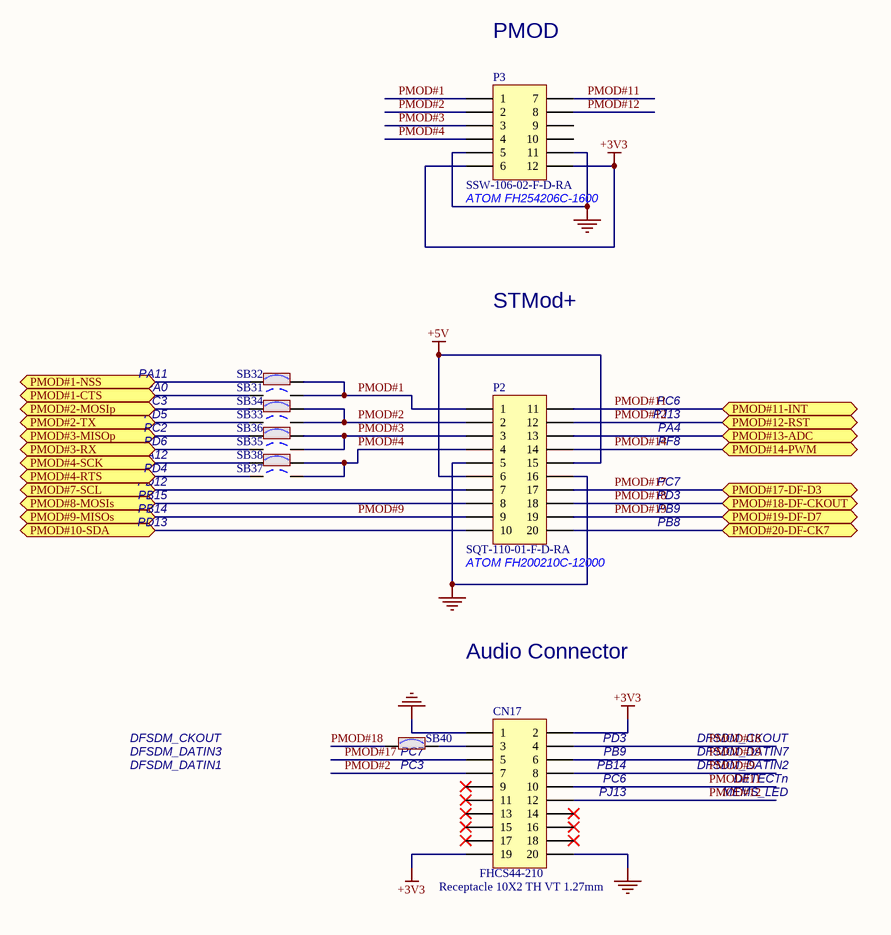
[diagram p15: PMOD_STMod+ connector .SchDoc]

### Parts
CN17  Receptacle 10X2 TH VT 1.27mm  Order_Code: FHCS44-210  [MODULE_20TH_48X29]
P2  SQT-110-01-F-D-RA  [SQT-110-01-F-D-RA]
P3  SSW-106-02-F-D-RA  [SSW-106-02-F-D-RA]
SB31  Solder Bridge OFF  [SB_0603]  (value not drawn)
SB32  Solder Bridge ON  [SB_0603]  (value not drawn)
SB33  Solder Bridge OFF  [SB_0603]  (value not drawn)
SB34  Solder Bridge ON  [SB_0603]  (value not drawn)
SB35  Solder Bridge OFF  [SB_0603]  (value not drawn)
SB36  Solder Bridge ON  [SB_0603]  (value not drawn)
SB37  Solder Bridge OFF  [SB_0603]  (value not drawn)
SB38  Solder Bridge ON  [SB_0603]  (value not drawn)
SB40  Solder Bridge ON  [SB_0603]  (value not drawn)

### Ports
PMOD#1-CTS (bidir), PMOD#1-NSS (bidir), PMOD#2-MOSIp (bidir), PMOD#2-TX (bidir), PMOD#3-MISOp (bidir), PMOD#3-RX (bidir), PMOD#4-RTS (bidir), PMOD#4-SCK (bidir), PMOD#7-SCL (bidir), PMOD#8-MOSIs (bidir), PMOD#9-MISOs (bidir), PMOD#10-SDA (bidir), PMOD#11-INT (bidir), PMOD#12-RST (bidir), PMOD#13-ADC (bidir), PMOD#14-PWM (bidir), PMOD#17-DF-D3 (bidir), PMOD#18-DF-CKOUT (bidir), PMOD#19-DF-D7 (bidir), PMOD#20-DF-CK7 (bidir)

### Nets
+3V3: CN17.2 CN17.19 P3.6 P3.12
+5V: P2.6 P2.15
GND: CN17.1 CN17.20 P2.5 P2.16 P3.5 P3.11
DCMI_D6: P2.20 ; port PMOD#20-DF-CK7
PA0: SB31.1 ; port PMOD#1-CTS
PA11: SB32.1 ; port PMOD#1-NSS
PA12: SB38.1 ; port PMOD#4-SCK
PB15: P2.8 ; port PMOD#8-MOSIs
PC2: SB36.1 ; port PMOD#3-MISOp
PC3: SB34.1 ; port PMOD#2-MOSIp
PD4: SB37.1 ; port PMOD#4-RTS
PD5: SB33.1 ; port PMOD#2-TX
PD6: SB35.1 ; port PMOD#3-RX
PMOD#1: P2.1 P3.1 SB31.2 SB32.2
PMOD#2: CN17.7 P2.2 P3.2 SB33.2 SB34.2
PMOD#3: P2.3 P3.3 SB35.2 SB36.2
PMOD#4: P2.4 P3.4 SB37.2 SB38.2
PMOD#9: CN17.8 P2.9 ; port PMOD#9-MISOs  [project net PB14]
PMOD#11: CN17.10 P2.11 P3.7 ; port PMOD#11-INT  [project net DCMI_D0]
PMOD#12: CN17.12 P2.12 P3.8 ; port PMOD#12-RST  [project net PJ13]
PMOD#14: P2.14 ; port PMOD#14-PWM  [project net PF8]
PMOD#17: CN17.5 P2.17 ; port PMOD#17-DF-D3  [project net DCMI_D1]
PMOD#18: CN17.4 P2.18 SB40.1 ; port PMOD#18-DF-CKOUT  [project net DCMI_D5]
PMOD#19: CN17.6 P2.19 ; port PMOD#19-DF-D7  [project net DCMI_D7]
NetCN17_3: CN17.3 SB40.2
NetP2_7: P2.7 ; port PMOD#7-SCL
NetP2_10: P2.10 ; port PMOD#10-SDA
NetP2_13: P2.13 ; port PMOD#13-ADC

Not connected (* = marked no-connect by the designer): CN17 9* 11* 13* 14* 15* 16* 17* 18*; P3 9 10

### Notes on the sheet
- PMOD
- (near P3) ATOM FH254206C-1600
- STMod+
- PA0
- PD5
- PC3
- PA11
- PJ13
- PC6
- PD6
- PC2
- PA12
- PD12
- PD4
- PA4
- PF8
- PC7
- PB15
- PB14
- PD13
- PD3
- PB9
- PB8
- (near P2) ATOM FH200210C-12000
- Audio Connector
- DFSDM_CKOUT
- DFSDM_DATIN3
- (near SB40) PC7
- DFSDM_DATIN7
- DFSDM_DATIN1
- (near SB40) PC3
- DFSDM_DATIN2
- DETECTn
- MEMS_LED
- Title:
- Project:
- Size:
- Revision:
- Variant:
- A4
- -
- Date:
- Reference:
- Sheet:
- of

### Library data of the parts
CN17 = Receptacle 10X2 TH VT 1.27mm: 20 Position Receptacle Connector 0.050" (1.27mm) Through Hole Vertical Mount; Manuf_1: WINPIN; Fitted: YES; Ordered_By: Subcon; Manuf_Part_1: FHCS44-210; Value: Receptacle 10X2 TH VT 1.27mm; Distrib: *; ECCN_US/EU: n/a
P2 = Header 10X2A: Header, 10-Pin, Dual row; LatestRevisionDate: 17-Jul-2002; LatestRevisionNote: Re-released for DXP Platform.; Publisher: Altium Limited
P3 = Header 6X2A: Header, 6-Pin, Dual row; LatestRevisionDate: 17-Jul-2002; LatestRevisionNote: Re-released for DXP Platform.; Publisher: Altium Limited
SB31 SB33 SB35 SB37 = SB_OFF: Fitted: NO; Ordered by: Subcon; Revision: July-2002: Re-released for DXP Platform.; ECCN_US/EU: n/a
SB32 SB34 SB36 SB38 SB40 = SB_ON: Fitted: YES; Ordered by: Subcon; Revision: July-2002: Re-released for DXP Platform.; ECCN_US/EU: n/a

## Nets that join several sheets
3V3_STLK: STLink_V3E_Module (6 pins), STLink_V3E_PWR (40 pins)
5V_USB_CHGR: Power (JP6.9), STLink_V3E_Module (C6.2 CN2.1 D3.1), STLink_V3E_PWR (5 pins)
5V_USB_PWR: Power (C75.2 CN14.1 JP6.3), STLink_V3E_PWR (D8.1)
5V_USB_STLK: Power (JP6.1), STLink_V3E_PWR (SB18.2)
+1V8: Audio (6 pins), Power (C42.1 TP2.1 U8.2 U8.4), USB_OTG  (C85.1 R32.1 U4.28 U4.30), LCD&Camera Connectors (C10.1 CN15.60)
+3V3: Top (R130.1 R131.1), MCU (5 pins), Memory (28 pins), QSPI (5 pins), Audio (15 pins), Ethernet (9 pins), Peripherals (16 pins), Arduino Connectors (CN8.2 CN8.4 R46.2), Power (7 pins), USB_OTG  (13 pins), LCD&Camera Connectors (7 pins), DEBUG (CN16.1), STLink_V3E_Module (CN13.3 R83.2), PMOD_STMod+ connector  (CN17.2 CN17.19 P3.6 P3.12)
+5V: Arduino Connectors (CN8.5), Power (9 pins), USB_OTG  (C12.1 U2.5 U4.21), LCD&Camera Connectors (L5.1), STLink_V3E_PWR (R85.2), PMOD_STMod+ connector  (P2.6 P2.15)
E5V: Arduino Connectors (R120.1), Power (C146.1 JP6.7 U19.2 U19.4), STLink_V3E_PWR (D6.1)
GND: MCU (10 pins), Memory (28 pins), QSPI (C13.2 C84.2 U3.10 U14.10), Audio (44 pins), Ethernet (18 pins), Peripherals (12 pins), Arduino Connectors (6 pins), Power (106 pins), USB_OTG  (29 pins), LCD&Camera Connectors (27 pins), DEBUG (CN16.3 CN16.5 D11.2 D12.2), STLink_V3E_Module (26 pins), STLink_V3E_PWR (71 pins), PMOD_STMod+ connector  (6 pins)
VBUS_HS: Power (JP6.5), USB_OTG  (CN1.1 D2.A1 L2.2), STLink_V3E_PWR (D7.1)
VIN: Arduino Connectors (CN8.8), Power (C143.1 U19.3)
VREF+: Arduino Connectors (C18.2 R43.2), Power (C87.1 C90.2 R158.2 U6.M1)
A0: MCU (R199.1), Memory (U7.G8)
A1: MCU (R198.1), Memory (U7.G9)
A2: MCU (R185.1), Memory (U7.F7)
A3: MCU (R186.1), Memory (U7.F3)
A4: MCU (R197.1), Memory (U7.G1)
A5: MCU (R184.1), Memory (U7.G2)
A6: MCU (R143.1), Memory (U7.G3)
A7: MCU (R145.1), Memory (U7.H1)
A8: MCU (R53.1), Memory (U7.H2)
A9: MCU (R147.1), Memory (U7.J3)
A10: MCU (R55.1), Memory (U7.G7)
A11: MCU (R54.1), Memory (U7.H9)
A12: MCU (R172.1), Memory (U7.H3)
A14: MCU (R168.1), Memory (U7.J7)
A15: MCU (R169.1), Memory (U7.H8)
BK2_IO0: MCU (R141.2), QSPI (R3.1 R125.1)
BK2_IO1: MCU (R139.2), QSPI (R19.2 R134.2)
BK2_IO2: MCU (R181.2), QSPI (R6.1 R124.1)
BK2_IO3: MCU (R178.2), QSPI (R18.2 R135.2)
Camera_CLK: USB_OTG  (R24.2), LCD&Camera Connectors (P1.21)
D0: MCU (R67.1), Memory (U7.R8)
D1: MCU (R65.1), Memory (U7.N7)
D2: MCU (R182.1), Memory (U7.R9)
D3: MCU (R180.1), Memory (U7.N8)
D4: MCU (R52.1), Memory (U7.P9)
D5: MCU (R51.1), Memory (U7.M8)
D6: MCU (R148.1), Memory (U7.M7)
D7: MCU (R146.1), Memory (U7.L8)
D8: MCU (R151.1), Memory (U7.L2)
D9: MCU (R149.1), Memory (U7.M3)
D10: MCU (R49.1), Memory (U7.M2)
D11: MCU (R50.1), Memory (U7.P1)
D12: MCU (R150.1), Memory (U7.N2)
D13: MCU (R59.1), Memory (U7.R1)
D14: MCU (R62.1), Memory (U7.N3)
D15: MCU (R60.1), Memory (U7.R2)
D16: MCU (R152.2), Memory (U7.E8)
D17: MCU (R159.2), Memory (U7.D7)
D18: MCU (R165.2), Memory (U7.D8)
D19: MCU (R162.2), Memory (U7.B9)
D20: MCU (R154.2), Memory (U7.C8)
D21: MCU (R183.2), Memory (U7.A9)
D22: MCU (R88.2), Memory (U7.C7)
D23: MCU (R89.2), Memory (U7.A8)
D24: MCU (R90.1), Memory (U7.A2)
D25: MCU (R92.1), Memory (U7.C3)
D26: MCU (R91.1), Memory (U7.A1)
D27: MCU (R195.1), Memory (U7.C2)
D28: MCU (R187.1), Memory (U7.B1)
D29: MCU (R188.1), Memory (U7.D2)
D30: MCU (R200.1), Memory (U7.D3)
D31: MCU (R201.1), Memory (U7.E2)
DCMI_D0: MCU (U6.F14), LCD&Camera Connectors (P1.4), PMOD_STMod+ connector  (CN17.10 P2.11 P3.7)
DCMI_D1: MCU (U6.F13), LCD&Camera Connectors (P1.5), PMOD_STMod+ connector  (CN17.5 P2.17)
DCMI_D2: MCU (U6.A9), LCD&Camera Connectors (P1.6)
DCMI_D3: MCU (U6.E14), Peripherals (R119.2 U13.A1), LCD&Camera Connectors (P1.7)
DCMI_D4: MCU (U6.B13), Peripherals (R116.2 U13.A5), LCD&Camera Connectors (P1.8)
DCMI_D5: MCU (U6.B12), LCD&Camera Connectors (P1.9), PMOD_STMod+ connector  (CN17.4 P2.18 SB40.1)
DCMI_D6: MCU (U6.D5), LCD&Camera Connectors (P1.10), PMOD_STMod+ connector  (P2.20)
DCMI_D7: MCU (U6.D4), LCD&Camera Connectors (P1.11), PMOD_STMod+ connector  (CN17.6 P2.19)
NCS2: MCU (R176.2), QSPI (R8.1 SB47.1 U3.7 U14.7)
NetB1_2: MCU (B1.2 B1.3 D13.1 R202.2), Ethernet (U18.15), USB_OTG  (SB30.1), LCD&Camera Connectors (P1.26), DEBUG (R210.2)
NetCN6_4: MCU (SB39.2), Arduino Connectors (CN6.4)
NetCN6_6: MCU (SB4.1), Arduino Connectors (CN6.6)
NetCN7_12: MCU (SB17.2), Ethernet (CN7.12 R80.1 R177.2 U18.2)
NetCN15_3: MCU (U6.L16), LCD&Camera Connectors (CN15.3)
NetCN15_5: MCU (U6.L17), LCD&Camera Connectors (CN15.5)
NetCN15_9: MCU (U6.M16), LCD&Camera Connectors (CN15.9)
NetCN15_11: MCU (U6.M17), LCD&Camera Connectors (CN15.11)
NetCN15_15: MCU (U6.K16), LCD&Camera Connectors (CN15.15)
NetCN15_17: MCU (U6.K17), LCD&Camera Connectors (CN15.17)
NetP2_13: MCU (SB3.1), PMOD_STMod+ connector  (P2.13)
NetR72_2: MCU (R72.2), Ethernet (U18.5)
NetR87_1: MCU (R87.1), Audio (SB45.2)
NetSB8_1: MCU (SB8.1), Ethernet (U18.13)
PA0: MCU (U6.N5), PMOD_STMod+ connector  (SB31.1)
PA0_C: MCU (U6.T1), Arduino Connectors (CN9.3)
PA1: MCU (U6.N4), Ethernet (R153.2)
PA1_C: MCU (U6.T2), Arduino Connectors (CN9.4)
PA2: MCU (U6.N3), Ethernet (R155.2)
PA3: MCU (U6.U2), USB_OTG  (R37.2)
PA4: MCU (SB3.2 U6.U3), Arduino Connectors (CN9.1), LCD&Camera Connectors (P1.17)
PA5: MCU (U6.T3), USB_OTG  (R35.2)
PA6: MCU (SB4.2 U6.R3), LCD&Camera Connectors (P1.15)
PA7: MCU (U6.R5), Ethernet (R160.2)
PA8: MCU (U6.E15), LCD&Camera Connectors (CN15.45)
PA11: MCU (U6.E17), PMOD_STMod+ connector  (SB32.1)
PA12: MCU (U6.E16), PMOD_STMod+ connector  (SB38.1)
PA13: MCU (U6.C15), DEBUG (R208.2)
PA14: MCU (U6.B14), DEBUG (R207.2)
PA15: MCU (U6.A14), DEBUG (R212.2)
PB0: MCU (U6.U5), USB_OTG  (R38.2)
PB1: MCU (U6.T5), USB_OTG  (R39.2)
PB2: MCU (R56.2), QSPI (SB25.2 U3.13 U3.16)
PB3: MCU (U6.C6), DEBUG (R206.2)
PB4: MCU (U6.B7), DEBUG (R211.2)
PB5: MCU (U6.A5), USB_OTG  (R21.2)
PB6: MCU (U6.B5), LCD&Camera Connectors (CN15.47)
PB7: MCU (U6.C5), LCD&Camera Connectors (P1.19)
PB10: MCU (U6.P11), USB_OTG  (R40.2)
PB11: MCU (U6.P12), USB_OTG  (R42.2)
PB12: MCU (U6.T14), USB_OTG  (R29.2)
PB13: MCU (U6.U14), USB_OTG  (R27.2)
PB14: MCU (U6.U15), PMOD_STMod+ connector  (CN17.8 P2.9)
PB15: MCU (U6.T15), PMOD_STMod+ connector  (P2.8)
PC0: MCU (U6.L2), USB_OTG  (R26.2)
PC1: MCU (SB8.2 U6.M2), Audio (SB21.2)
PC2: MCU (U6.M3), PMOD_STMod+ connector  (SB36.1)
PC2_C: MCU (U6.R1), Arduino Connectors (SB23.1)
PC3: MCU (U6.M4), PMOD_STMod+ connector  (SB34.1)
PC3_C: MCU (U6.R2), Arduino Connectors (SB6.1)
PC4: MCU (U6.T4), Ethernet (R171.2)
PC5: MCU (U6.U4), Ethernet (R175.2)
PC8: MCU (U6.E13), Peripherals (R118.2 U13.A2)
PC10: MCU (U6.A13), Peripherals (R115.2 U13.A6)
PC12: MCU (U6.C12), Peripherals (U13.A3)
PC13: MCU (U6.E3), Peripherals (R215.2)
PD2: MCU (U6.D12), Peripherals (R117.2 U13.A4)
PD4: MCU (U6.A12), PMOD_STMod+ connector  (SB37.1)
PD5: MCU (U6.A11), PMOD_STMod+ connector  (SB33.1)
PD6: MCU (U6.B11), PMOD_STMod+ connector  (SB35.1)
PD7: MCU (U6.C11), Audio (R127.2 R129.2 U15.4)
PD11: MCU (R157.2), QSPI (R2.1)
PD12: MCU (U6.R16), Audio (R103.1), LCD&Camera Connectors (CN15.44 R4.1)
PD13: MCU (U6.R17), Audio (R105.1), LCD&Camera Connectors (CN15.40 R5.1)
PE0: MCU (U6.C4), Memory (U7.K9)
PE1: MCU (U6.B4), Memory (U7.K1)
PE3: MCU (U6.D3), Audio (U12.F2)
PE4: MCU (U6.D2), Audio (U12.E3)
PE5: MCU (U6.D1), Audio (U12.G1)
PE6: MCU (U6.E5), Audio (U12.E4)
PF6: MCU (R69.1), QSPI (R15.2)
PF7: MCU (U6.K3), QSPI (R1.1)
PF8: MCU (SB39.1 U6.K4), PMOD_STMod+ connector  (P2.14)
PF9: MCU (R140.1), QSPI (R20.2)
PF10: MCU (U6.L3), Arduino Connectors (CN9.2)
PF11: MCU (R144.1), Memory (U7.J9)
PG3: MCU (R82.1), LCD&Camera Connectors (CN15.57 R123.1)
PG7: MCU (U6.F16), Audio (U12.D3)
PG8: MCU (R179.1), Memory (U7.J1)
PG11: MCU (R93.1), Ethernet (U18.16)
PG12: MCU (R193.1), Ethernet (U18.18)
PG13: MCU (R194.1), Ethernet (U18.17)
PG15: MCU (R189.1), Memory (U7.K7)
PH4: MCU (U6.P3), USB_OTG  (R36.2)
PH5: MCU (R142.2), Memory (U7.K8)
PH6: MCU (R48.2), Memory (U7.J8)
PH7: MCU (U6.U13), Memory (R47.2)
PI4: MCU (U6.A4), Memory (U7.F8)
PI5: MCU (U6.A3), Memory (U7.F2)
PI8: MCU (U6.E4), Peripherals (R121.1 R122.1)
PI11: MCU (U6.F4), USB_OTG  (R28.2)
PI12: MCU (U6.H1), Peripherals (R203.1)
PI13: MCU (U6.H2), Peripherals (R204.1)
PI14: MCU (U6.H3), Peripherals (R205.1)
PI15: MCU (U6.P5), Peripherals (R209.1)
PJ0: MCU (U6.N6), Arduino Connectors (CN6.8)
PJ1: MCU (U6.P6), USB_OTG  (R7.1)
PJ2: MCU (U6.T6), LCD&Camera Connectors (CN15.49)
PJ3: MCU (U6.U6), Arduino Connectors (CN6.3)
PJ4: MCU (U6.U7), Arduino Connectors (CN6.5)
PJ5: MCU (U6.R12), Arduino Connectors (CN5.1)
PJ6: MCU (U6.N15), Arduino Connectors (CN5.2)
PJ7: MCU (U6.N14), Arduino Connectors (CN6.7)
PJ8: MCU (U6.N13), Arduino Connectors (CN6.2)
PJ9: MCU (U6.M14), Arduino Connectors (CN6.1)
PJ10: MCU (U6.L14), Arduino Connectors (CN5.4)
PJ11: MCU (U6.K14), Arduino Connectors (CN5.5)
PJ12: MCU (U6.D11), LCD&Camera Connectors (CN15.53)
PJ13: MCU (U6.E10), PMOD_STMod+ connector  (CN17.12 P2.12 P3.8)
PJ14: MCU (U6.D10), LCD&Camera Connectors (P1.25)
PJ15: MCU (U6.B10), Audio (U12.G3)
PK0: MCU (U6.J14), Arduino Connectors (CN5.6 SB5.2)
PK1: MCU (U6.J15), Arduino Connectors (CN5.3)
PK2: MCU (U6.H17), Peripherals (B3.2 D9.6)
PK3: MCU (U6.C8), Peripherals (B3.3 D9.5)
PK4: MCU (U6.B8), Peripherals (B3.1 D9.4)
PK5: MCU (U6.A8), Peripherals (B3.4 D9.3)
PK6: MCU (U6.C7), Peripherals (B3.6 D9.1)
PK7: MCU (U6.D7), LCD&Camera Connectors (CN15.4)
T_PWR_EN: STLink_V3E_Module (U9.R5), STLink_V3E_PWR (R107.2 U10.4)
T_PWR_EXT: STLink_V3E_Module (U9.R4), STLink_V3E_PWR (R84.2 R85.1 SB13.2)

## Assembly variants
H747I: not fitted C6 C15 C21 C40 C55 CN4 CN16 D1 D2 H1 H2 H3 H4 H5 H6 H7 H8 JP1 JP4 R3 R6 R14 R18 R19 R22 R30 R34 R43 R108 R121 R123 R129 R136 R177 R190 R192 SB1 SB7 SB8 SB12 SB13 SB14 SB15 SB17 SB22 SB24 SB30 SB31 SB33 SB35 SB37 SB41 SB43 SB44 SB47 SB49 T3 TP1 TP2 TP3 TP4 TP5